# Altium schematic sheet Connector.SchDoc
size A3; Organization: Altium Limited; Address1: L3, 12a Rodborough Rd; Address2: Frenchs Forest; Address3: NSW; Address4: Australia 2086
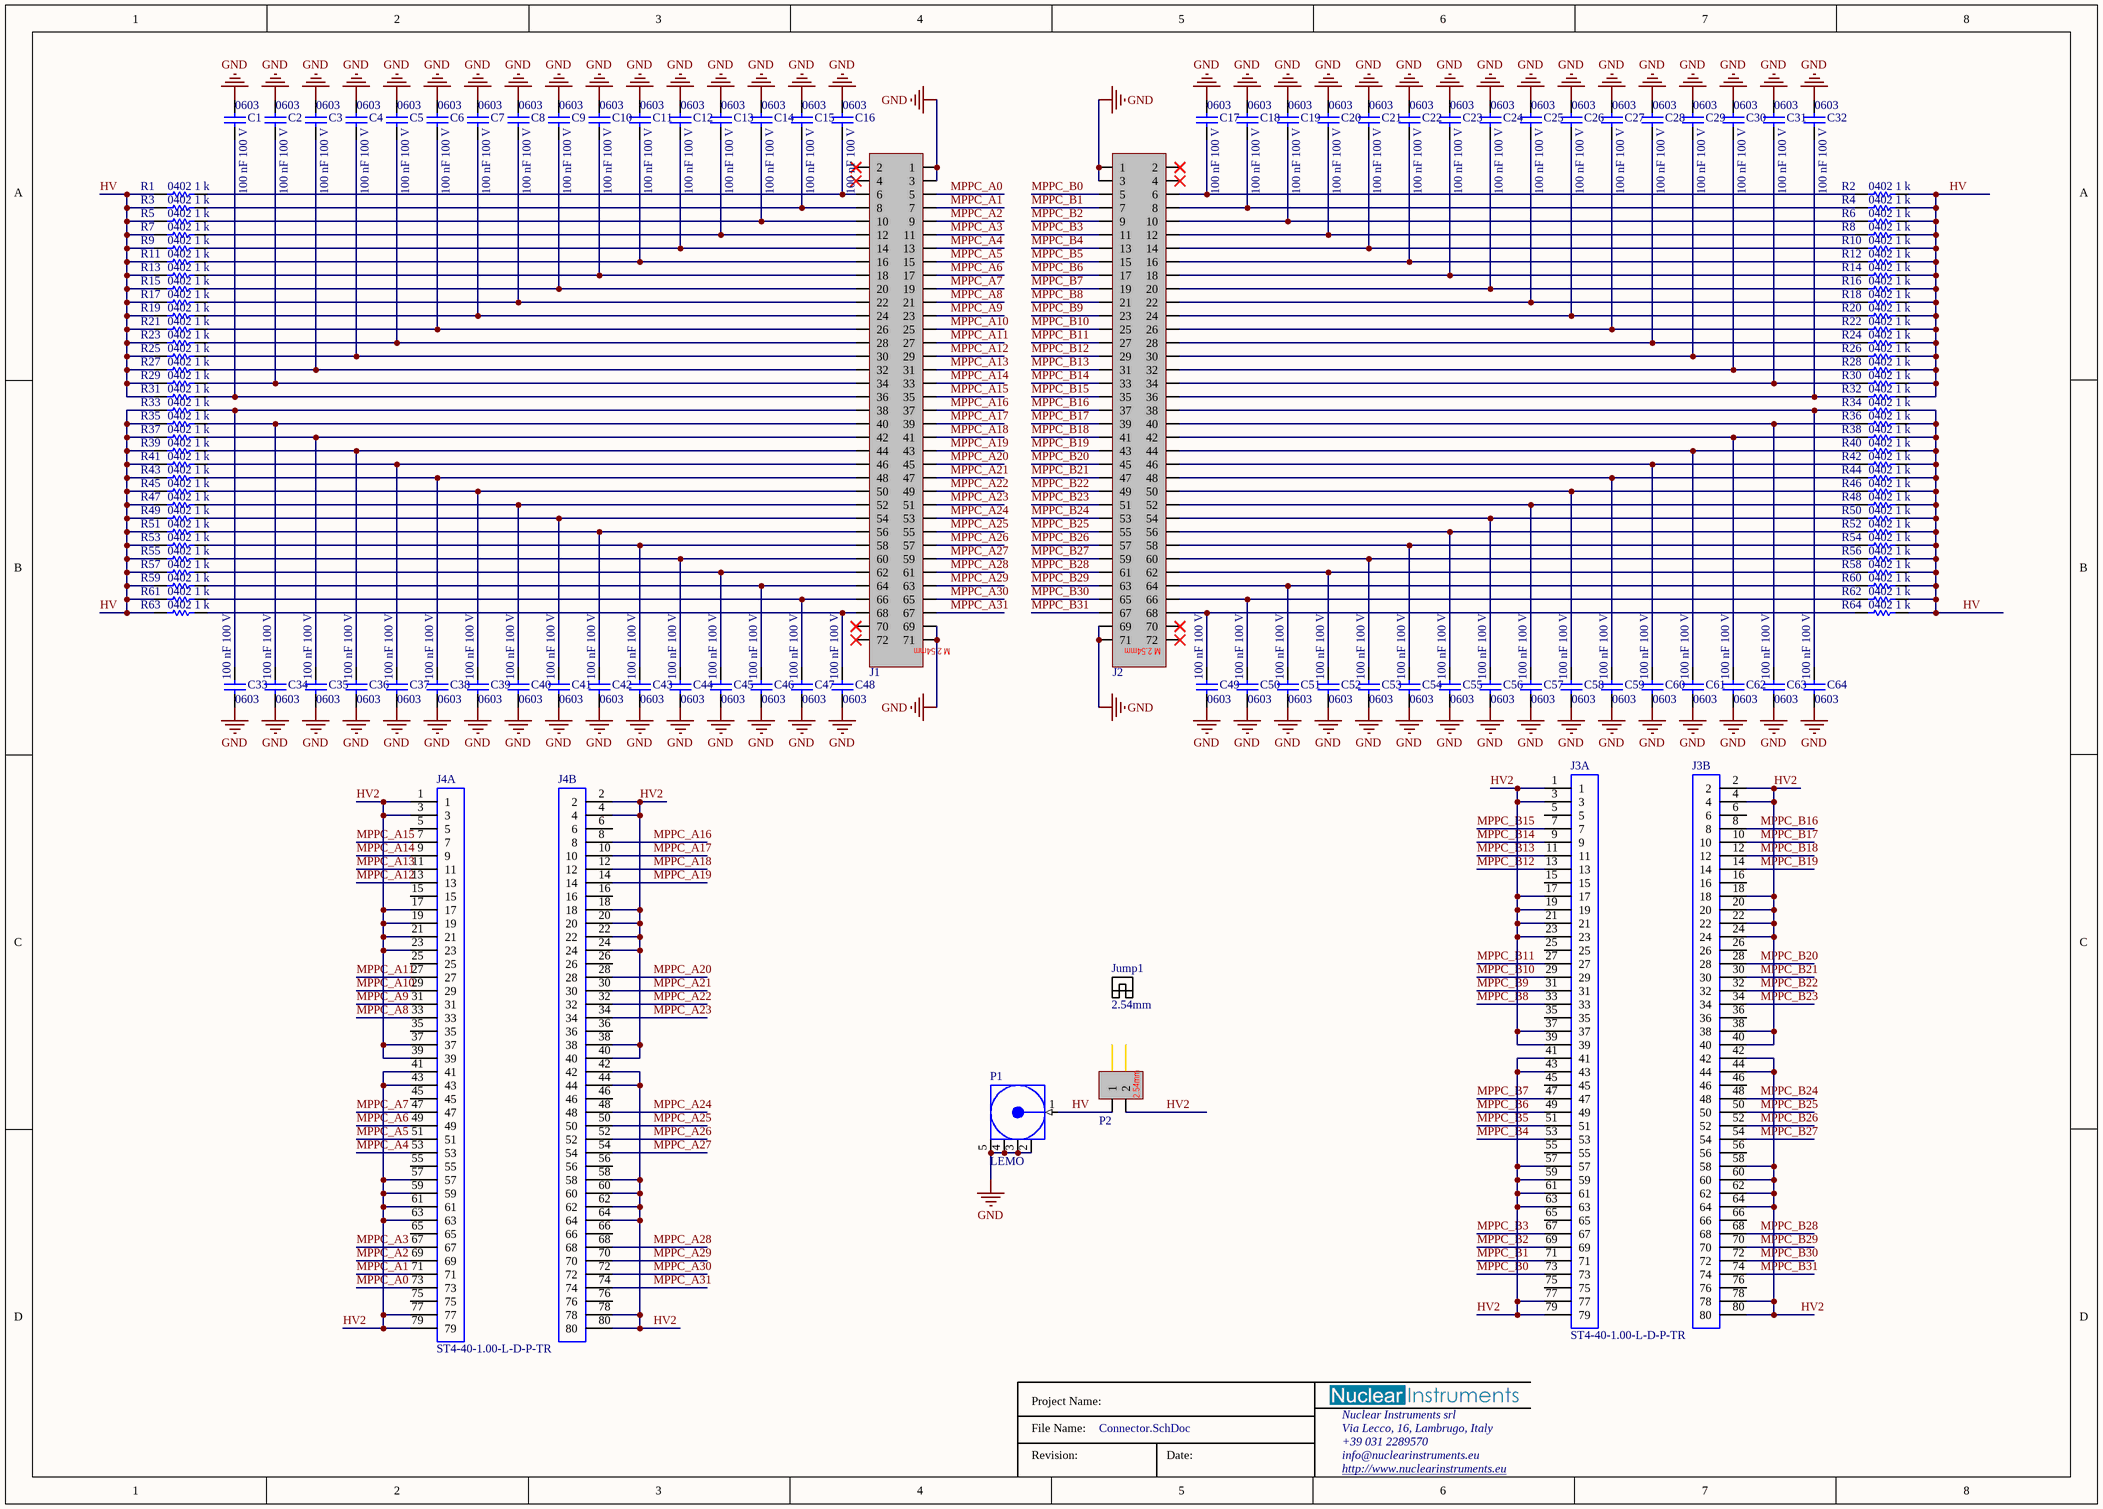
[diagram p0: Connector.SchDoc]

## Parts
C1  0603  value 100 nF 100 V  [CAPCERSMD0603]
C2  0603  value 100 nF 100 V  [CAPCERSMD0603]
C3  0603  value 100 nF 100 V  [CAPCERSMD0603]
C4  0603  value 100 nF 100 V  [CAPCERSMD0603]
C5  0603  value 100 nF 100 V  [CAPCERSMD0603]
C6  0603  value 100 nF 100 V  [CAPCERSMD0603]
C7  0603  value 100 nF 100 V  [CAPCERSMD0603]
C8  0603  value 100 nF 100 V  [CAPCERSMD0603]
C9  0603  value 100 nF 100 V  [CAPCERSMD0603]
C10  0603  value 100 nF 100 V  [CAPCERSMD0603]
C11  0603  value 100 nF 100 V  [CAPCERSMD0603]
C12  0603  value 100 nF 100 V  [CAPCERSMD0603]
C13  0603  value 100 nF 100 V  [CAPCERSMD0603]
C14  0603  value 100 nF 100 V  [CAPCERSMD0603]
C15  0603  value 100 nF 100 V  [CAPCERSMD0603]
C16  0603  value 100 nF 100 V  [CAPCERSMD0603]
C17  0603  value 100 nF 100 V  [CAPCERSMD0603]
C18  0603  value 100 nF 100 V  [CAPCERSMD0603]
C19  0603  value 100 nF 100 V  [CAPCERSMD0603]
C20  0603  value 100 nF 100 V  [CAPCERSMD0603]
C21  0603  value 100 nF 100 V  [CAPCERSMD0603]
C22  0603  value 100 nF 100 V  [CAPCERSMD0603]
C23  0603  value 100 nF 100 V  [CAPCERSMD0603]
C24  0603  value 100 nF 100 V  [CAPCERSMD0603]
C25  0603  value 100 nF 100 V  [CAPCERSMD0603]
C26  0603  value 100 nF 100 V  [CAPCERSMD0603]
C27  0603  value 100 nF 100 V  [CAPCERSMD0603]
C28  0603  value 100 nF 100 V  [CAPCERSMD0603]
C29  0603  value 100 nF 100 V  [CAPCERSMD0603]
C30  0603  value 100 nF 100 V  [CAPCERSMD0603]
C31  0603  value 100 nF 100 V  [CAPCERSMD0603]
C32  0603  value 100 nF 100 V  [CAPCERSMD0603]
C33  0603  value 100 nF 100 V  [CAPCERSMD0603]
C34  0603  value 100 nF 100 V  [CAPCERSMD0603]
C35  0603  value 100 nF 100 V  [CAPCERSMD0603]
C36  0603  value 100 nF 100 V  [CAPCERSMD0603]
C37  0603  value 100 nF 100 V  [CAPCERSMD0603]
C38  0603  value 100 nF 100 V  [CAPCERSMD0603]
C39  0603  value 100 nF 100 V  [CAPCERSMD0603]
C40  0603  value 100 nF 100 V  [CAPCERSMD0603]
C41  0603  value 100 nF 100 V  [CAPCERSMD0603]
C42  0603  value 100 nF 100 V  [CAPCERSMD0603]
C43  0603  value 100 nF 100 V  [CAPCERSMD0603]
C44  0603  value 100 nF 100 V  [CAPCERSMD0603]
C45  0603  value 100 nF 100 V  [CAPCERSMD0603]
C46  0603  value 100 nF 100 V  [CAPCERSMD0603]
C47  0603  value 100 nF 100 V  [CAPCERSMD0603]
C48  0603  value 100 nF 100 V  [CAPCERSMD0603]
C49  0603  value 100 nF 100 V  [CAPCERSMD0603]
C50  0603  value 100 nF 100 V  [CAPCERSMD0603]
C51  0603  value 100 nF 100 V  [CAPCERSMD0603]
C52  0603  value 100 nF 100 V  [CAPCERSMD0603]
C53  0603  value 100 nF 100 V  [CAPCERSMD0603]
C54  0603  value 100 nF 100 V  [CAPCERSMD0603]
C55  0603  value 100 nF 100 V  [CAPCERSMD0603]
C56  0603  value 100 nF 100 V  [CAPCERSMD0603]
C57  0603  value 100 nF 100 V  [CAPCERSMD0603]
C58  0603  value 100 nF 100 V  [CAPCERSMD0603]
C59  0603  value 100 nF 100 V  [CAPCERSMD0603]
C60  0603  value 100 nF 100 V  [CAPCERSMD0603]
C61  0603  value 100 nF 100 V  [CAPCERSMD0603]
C62  0603  value 100 nF 100 V  [CAPCERSMD0603]
C63  0603  value 100 nF 100 V  [CAPCERSMD0603]
C64  0603  value 100 nF 100 V  [CAPCERSMD0603]
J1  Male 72 pin, dual row, 2.54 mm pitch  [Wurth_WR-PHD_male_2rows_vertical_2.54pitch_72ways]  (value not drawn)
J2  Male 72 pin, dual row, 2.54 mm pitch  [Wurth_WR-PHD_male_2rows_vertical_2.54pitch_72ways]  (value not drawn)
J3  ST4-40-1.00-L-D-P-TR  [Samtec_ST4-40-1.00-L-D-P-TR]  (parts A,B of 2)
J4  ST4-40-1.00-L-D-P-TR  [Samtec_ST4-40-1.00-L-D-P-TR]  (parts A,B of 2)
Jump1  2.54mm  (mechanical)
P1  LEMO  [LEMO_EPA.00.250.DTN_Vertical]
P2  Wurth_WR-PHD_2way_2.54mm_male  [Wurth_WR-PHD_2way_2.54mm_male]  (value not drawn)
R1  0402  value 1 k  [RESSMD0402]
R2  0402  value 1 k  [RESSMD0402]
R3  0402  value 1 k  [RESSMD0402]
R4  0402  value 1 k  [RESSMD0402]
R5  0402  value 1 k  [RESSMD0402]
R6  0402  value 1 k  [RESSMD0402]
R7  0402  value 1 k  [RESSMD0402]
R8  0402  value 1 k  [RESSMD0402]
R9  0402  value 1 k  [RESSMD0402]
R10  0402  value 1 k  [RESSMD0402]
R11  0402  value 1 k  [RESSMD0402]
R12  0402  value 1 k  [RESSMD0402]
R13  0402  value 1 k  [RESSMD0402]
R14  0402  value 1 k  [RESSMD0402]
R15  0402  value 1 k  [RESSMD0402]
R16  0402  value 1 k  [RESSMD0402]
R17  0402  value 1 k  [RESSMD0402]
R18  0402  value 1 k  [RESSMD0402]
R19  0402  value 1 k  [RESSMD0402]
R20  0402  value 1 k  [RESSMD0402]
R21  0402  value 1 k  [RESSMD0402]
R22  0402  value 1 k  [RESSMD0402]
R23  0402  value 1 k  [RESSMD0402]
R24  0402  value 1 k  [RESSMD0402]
R25  0402  value 1 k  [RESSMD0402]
R26  0402  value 1 k  [RESSMD0402]
R27  0402  value 1 k  [RESSMD0402]
R28  0402  value 1 k  [RESSMD0402]
R29  0402  value 1 k  [RESSMD0402]
R30  0402  value 1 k  [RESSMD0402]
R31  0402  value 1 k  [RESSMD0402]
R32  0402  value 1 k  [RESSMD0402]
R33  0402  value 1 k  [RESSMD0402]
R34  0402  value 1 k  [RESSMD0402]
R35  0402  value 1 k  [RESSMD0402]
R36  0402  value 1 k  [RESSMD0402]
R37  0402  value 1 k  [RESSMD0402]
R38  0402  value 1 k  [RESSMD0402]
R39  0402  value 1 k  [RESSMD0402]
R40  0402  value 1 k  [RESSMD0402]
R41  0402  value 1 k  [RESSMD0402]
R42  0402  value 1 k  [RESSMD0402]
R43  0402  value 1 k  [RESSMD0402]
R44  0402  value 1 k  [RESSMD0402]
R45  0402  value 1 k  [RESSMD0402]
R46  0402  value 1 k  [RESSMD0402]
R47  0402  value 1 k  [RESSMD0402]
R48  0402  value 1 k  [RESSMD0402]
R49  0402  value 1 k  [RESSMD0402]
R50  0402  value 1 k  [RESSMD0402]
R51  0402  value 1 k  [RESSMD0402]
R52  0402  value 1 k  [RESSMD0402]
R53  0402  value 1 k  [RESSMD0402]
R54  0402  value 1 k  [RESSMD0402]
R55  0402  value 1 k  [RESSMD0402]
R56  0402  value 1 k  [RESSMD0402]
R57  0402  value 1 k  [RESSMD0402]
R58  0402  value 1 k  [RESSMD0402]
R59  0402  value 1 k  [RESSMD0402]
R60  0402  value 1 k  [RESSMD0402]
R61  0402  value 1 k  [RESSMD0402]
R62  0402  value 1 k  [RESSMD0402]
R63  0402  value 1 k  [RESSMD0402]
R64  0402  value 1 k  [RESSMD0402]

## Nets
GND: C1.2 C2.2 C3.2 C4.2 C5.2 C6.2 C7.2 C8.2 C9.2 C10.2 C11.2 C12.2 C13.2 C14.2 C15.2 C16.2 C17.2 C18.2 C19.2 C20.2 C21.2 C22.2 C23.2 C24.2 C25.2 C26.2 C27.2 C28.2 C29.2 C30.2 C31.2 C32.2 C33.2 C34.2 C35.2 C36.2 C37.2 C38.2 C39.2 C40.2 C41.2 C42.2 C43.2 C44.2 C45.2 C46.2 C47.2 C48.2 C49.2 C50.2 C51.2 C52.2 C53.2 C54.2 C55.2 C56.2 C57.2 C58.2 C59.2 C60.2 C61.2 C62.2 C63.2 C64.2 J1.1 J1.3 J1.69 J1.71 J2.1 J2.3 J2.69 J2.71 P1.2(GND) P1.3(GND) P1.4(GND) P1.5(GND)
HV: P1.1(Signal) P2.1 R1.1 R2.2 R3.1 R4.2 R5.1 R6.2 R7.1 R8.2 R9.1 R10.2 R11.1 R12.2 R13.1 R14.2 R15.1 R16.2 R17.1 R18.2 R19.1 R20.2 R21.1 R22.2 R23.1 R24.2 R25.1 R26.2 R27.1 R28.2 R29.1 R30.2 R31.1 R32.2 R33.1 R34.2 R35.1 R36.2 R37.1 R38.2 R39.1 R40.2 R41.1 R42.2 R43.1 R44.2 R45.1 R46.2 R47.1 R48.2 R49.1 R50.2 R51.1 R52.2 R53.1 R54.2 R55.1 R56.2 R57.1 R58.2 R59.1 R60.2 R61.1 R62.2 R63.1 R64.2
HV2: J3.1 J3.2 J3.3 J3.4 J3.17 J3.18 J3.19 J3.20 J3.21 J3.22 J3.23 J3.24 J3.37 J3.38 J3.39 J3.40 J3.41 J3.42 J3.43 J3.44 J3.57 J3.58 J3.59 J3.60 J3.61 J3.62 J3.63 J3.64 J3.77 J3.78 J3.79 J3.80 J4.1 J4.2 J4.3 J4.4 J4.17 J4.18 J4.19 J4.20 J4.21 J4.22 J4.23 J4.24 J4.37 J4.38 J4.39 J4.40 J4.41 J4.42 J4.43 J4.44 J4.57 J4.58 J4.59 J4.60 J4.61 J4.62 J4.63 J4.64 J4.77 J4.78 J4.79 J4.80 P2.2
MPPC_A0: J1.5 J4.73
MPPC_A1: J1.7 J4.71
MPPC_A2: J1.9 J4.69
MPPC_A3: J1.11 J4.67
MPPC_A4: J1.13 J4.53
MPPC_A5: J1.15 J4.51
MPPC_A6: J1.17 J4.49
MPPC_A7: J1.19 J4.47
MPPC_A8: J1.21 J4.33
MPPC_A9: J1.23 J4.31
MPPC_A10: J1.25 J4.29
MPPC_A11: J1.27 J4.27
MPPC_A12: J1.29 J4.13
MPPC_A13: J1.31 J4.11
MPPC_A14: J1.33 J4.9
MPPC_A15: J1.35 J4.7
MPPC_A16: J1.37 J4.8
MPPC_A17: J1.39 J4.10
MPPC_A18: J1.41 J4.12
MPPC_A19: J1.43 J4.14
MPPC_A20: J1.45 J4.28
MPPC_A21: J1.47 J4.30
MPPC_A22: J1.49 J4.32
MPPC_A23: J1.51 J4.34
MPPC_A24: J1.53 J4.48
MPPC_A25: J1.55 J4.50
MPPC_A26: J1.57 J4.52
MPPC_A27: J1.59 J4.54
MPPC_A28: J1.61 J4.68
MPPC_A29: J1.63 J4.70
MPPC_A30: J1.65 J4.72
MPPC_A31: J1.67 J4.74
MPPC_B0: J2.5 J3.73
MPPC_B1: J2.7 J3.71
MPPC_B2: J2.9 J3.69
MPPC_B3: J2.11 J3.67
MPPC_B4: J2.13 J3.53
MPPC_B5: J2.15 J3.51
MPPC_B6: J2.17 J3.49
MPPC_B7: J2.19 J3.47
MPPC_B8: J2.21 J3.33
MPPC_B9: J2.23 J3.31
MPPC_B10: J2.25 J3.29
MPPC_B11: J2.27 J3.27
MPPC_B12: J2.29 J3.13
MPPC_B13: J2.31 J3.11
MPPC_B14: J2.33 J3.9
MPPC_B15: J2.35 J3.7
MPPC_B16: J2.37 J3.8
MPPC_B17: J2.39 J3.10
MPPC_B18: J2.41 J3.12
MPPC_B19: J2.43 J3.14
MPPC_B20: J2.45 J3.28
MPPC_B21: J2.47 J3.30
MPPC_B22: J2.49 J3.32
MPPC_B23: J2.51 J3.34
MPPC_B24: J2.53 J3.48
MPPC_B25: J2.55 J3.50
MPPC_B26: J2.57 J3.52
MPPC_B27: J2.59 J3.54
MPPC_B28: J2.61 J3.68
MPPC_B29: J2.63 J3.70
MPPC_B30: J2.65 J3.72
MPPC_B31: J2.67 J3.74
NetC1_1: C1.1 J1.36 R31.2
NetC2_1: C2.1 J1.34 R29.2
NetC3_1: C3.1 J1.32 R27.2
NetC4_1: C4.1 J1.30 R25.2
NetC5_1: C5.1 J1.28 R23.2
NetC6_1: C6.1 J1.26 R21.2
NetC7_1: C7.1 J1.24 R19.2
NetC8_1: C8.1 J1.22 R17.2
NetC9_1: C9.1 J1.20 R15.2
NetC10_1: C10.1 J1.18 R13.2
NetC11_1: C11.1 J1.16 R11.2
NetC12_1: C12.1 J1.14 R9.2
NetC13_1: C13.1 J1.12 R7.2
NetC14_1: C14.1 J1.10 R5.2
NetC15_1: C15.1 J1.8 R3.2
NetC16_1: C16.1 J1.6 R1.2
NetC17_1: C17.1 J2.6 R2.1
NetC18_1: C18.1 J2.8 R4.1
NetC19_1: C19.1 J2.10 R6.1
NetC20_1: C20.1 J2.12 R8.1
NetC21_1: C21.1 J2.14 R10.1
NetC22_1: C22.1 J2.16 R12.1
NetC23_1: C23.1 J2.18 R14.1
NetC24_1: C24.1 J2.20 R16.1
NetC25_1: C25.1 J2.22 R18.1
NetC26_1: C26.1 J2.24 R20.1
NetC27_1: C27.1 J2.26 R22.1
NetC28_1: C28.1 J2.28 R24.1
NetC29_1: C29.1 J2.30 R26.1
NetC30_1: C30.1 J2.32 R28.1
NetC31_1: C31.1 J2.34 R30.1
NetC32_1: C32.1 J2.36 R32.1
NetC33_1: C33.1 J1.38 R33.2
NetC34_1: C34.1 J1.40 R35.2
NetC35_1: C35.1 J1.42 R37.2
NetC36_1: C36.1 J1.44 R39.2
NetC37_1: C37.1 J1.46 R41.2
NetC38_1: C38.1 J1.48 R43.2
NetC39_1: C39.1 J1.50 R45.2
NetC40_1: C40.1 J1.52 R47.2
NetC41_1: C41.1 J1.54 R49.2
NetC42_1: C42.1 J1.56 R51.2
NetC43_1: C43.1 J1.58 R53.2
NetC44_1: C44.1 J1.60 R55.2
NetC45_1: C45.1 J1.62 R57.2
NetC46_1: C46.1 J1.64 R59.2
NetC47_1: C47.1 J1.66 R61.2
NetC48_1: C48.1 J1.68 R63.2
NetC49_1: C49.1 J2.68 R64.1
NetC50_1: C50.1 J2.66 R62.1
NetC51_1: C51.1 J2.64 R60.1
NetC52_1: C52.1 J2.62 R58.1
NetC53_1: C53.1 J2.60 R56.1
NetC54_1: C54.1 J2.58 R54.1
NetC55_1: C55.1 J2.56 R52.1
NetC56_1: C56.1 J2.54 R50.1
NetC57_1: C57.1 J2.52 R48.1
NetC58_1: C58.1 J2.50 R46.1
NetC59_1: C59.1 J2.48 R44.1
NetC60_1: C60.1 J2.46 R42.1
NetC61_1: C61.1 J2.44 R40.1
NetC62_1: C62.1 J2.42 R38.1
NetC63_1: C63.1 J2.40 R36.1
NetC64_1: C64.1 J2.38 R34.1

Not connected (* = marked no-connect by the designer): J1 2* 4* 70* 72*; J2 2* 4* 70* 72*; J3 5 6 15 16 25 26 35 36 45 46 55 56 65 66 75 76; J4 5 6 15 16 25 26 35 36 45 46 55 56 65 66 75 76

## Notes on the sheet
- Project Name:
- Revision:
- File Name:
- Date:
- Nuclear Instruments srl
- Via Lecco, 16, Lambrugo, Italy
- +39 031 2289570
- info@nuclearinstruments.eu
- http://www.nuclearinstruments.eu
- (in symbol Wurth_WR-PHD_2way_2.54mm_male) 2.54mm
- (in symbol Wurth_WR-PHD_male_2rows_vertical_2.54pitch_72ways) M 2.54mm

## Library data of the parts
C1-C64 = CAPCER0603_X7R_100V_100n
J1 J2 = Wurth_WR-PHD_male_2rows_vertical_2.54pitch_72ways: WR-PHD 2.54 mm Dual Pin Header, 72p
J3 J4 = Samtec_ST4-40-1.00-L-D-P-TR: ULTRA FINE PITCH SOCKET
Jump1 = SNT-100-BK-G
P1 = LEMO_EPA.00.250.DTN_Vertical: LEMO EPA 00 Vertical
P2 = Wurth_WR-PHD_2way_2.54mm_male: Male 2 way 2.54 mm
R1-R64 = RES0402-1k